# Altium project Encoder.PrjPcb
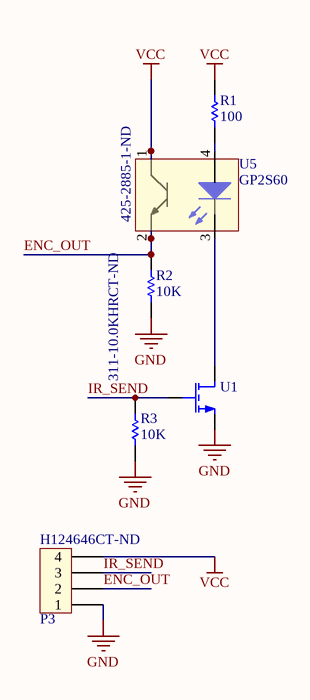
[diagram p0: Schematic_IR_encoder_v2.SchDoc]
1 sheet, 6 parts. Net scope: global (net labels, ports and power ports of the same name join across sheets).
Board files: PCB_Encoder_v2_single_16.PcbDoc, PCB_IR_Encoder_v2.PcbDoc, PCB_Flex_cable_Encoder.PcbDoc

## Sheet Schematic_IR_encoder_v2.SchDoc: IR Encoder Board
size A; Author: Artem Dementyev; Revision: 2; SheetNumber: 1; SheetTotal: 1; Designer: Artem Dementyev

### Parts
P3  Supplier Part Number 1: H124646CT-ND  [FH33J-4S-0.5SH(99)]  (hidden comment: FH33J-4S-0.5SH(99))
R1  100  [0603W]
R2  10K  Supplier Part Number 1: 311-10.0KHRCT-ND  [0603W]
R3  10K  [0603W]
U1  MOSFET N CHANNEL  [SOT323]  (value not drawn)
U5  GP2S60  Supplier Part Number 1: 425-2885-1-ND  [GP2S60]

### Nets
GND: P3.1 R2.1 R3.1 U1.2(S)
VCC: P3.4 R1.2 U5.1
ENC_OUT: P3.2 R2.2 U5.2
IR_SEND: P3.3 R3.2 U1.1(G)
NetR1_1: R1.1 U5.4
NetU1_3: U1.3(D) U5.3

### Notes on the sheet
- Title
- Designed by
- Ver
- Date:
- Time:

### Library data of the parts
P3 = FH33J-4S-0.5SH(99): 0.5mm FPC connector; Manufacturer: Hirose Electric Co Ltd; Flat Flex Type: FFC, FPC; Connector/Contact Type: Contacts, Bottom; Number of Positions: 4; Pitch: 0.020" (0.50mm); FFC, FCB Thickness: 0.30mm; Locking Feature: Flip Lock; Cable End Type: Tapered; Actuator Material: Polyphenylene Sulfide (PPS); Voltage Rating: 50V; Material Flammability Rating: UL94 V-0; Current Rating: 0.5A; digikey part number: H124646CT-ND; Supplier 1: Digi-Key; Manufacturer Part Number: FH33J-4S-0.5SH(99); RoHS: RoHS Compliant; Category: Connectors, Interconnects; Stock 1: 1775; Pricing 1: 1=2.05, 10=1.86, 25=1.7456, 50=1.6698, 100=1.5939, 250=1.44212 (USD); Packaging: Cut Tape (CT); Part Status: Active; Mounting Type: Surface Mount, Right Angle; Termination: Solder; Height Above Board: 0.047" (1.20mm); Contact Material: Phosphor Bronze; Contact Finish: Gold; Housing Material: Liquid Crystal Polymer (LCP), Halogen Free; Features: Zero Insertion Force (ZIF); Operating Temperature: -55°C ~ 85°C; ComponentLink1URL: https://www.hirose.com/product/en/download_file/key_name/FH33/category/Catalog/doc_file_id/49357/?file_category_id=4&item_id=304&is_series=1; ComponentLink1Description: https://www.hirose.com/product/en/download_file/key_name/FH33/category/Catalog/doc_file_id/49357/?file_category_id=4&item_id=304&is_series=1
R1-R3 = Resistor
  R1: digikey number: RMCF0603FT10K0CT-ND; Supplier 1: Digi-Key; Supplier Part Number 1: 311-100HRCT-ND
  R2: digikey number: RMCF0603FT10K0CT-ND; Supplier 1: Digi-Key
  R3: digikey part number: *; manufacturer: *; manufacturer part number: *
U1 = MOSFET N CHANNEL: digikey part number: 568-5987-1-ND; Supplier 1: Digi-Key; Supplier Part Number 1: 568-5987-1-ND
U5 = GP2S60: digikey part number: 425-2885-1-ND; Supplier 1: Digi-Key